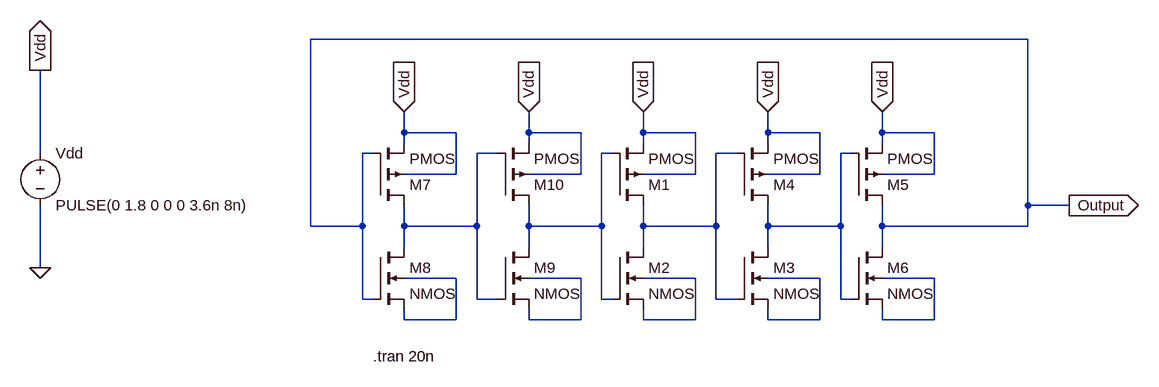
[diagram p0: schematic 5_ring_osc.asc]
5_ring_osc.asc, the LTspice schematic file:
Version 4
SHEET 1 1800 900
WIRE 1104 -96 0 -96
WIRE 144 48 144 16
WIRE 224 48 144 48
WIRE 336 48 336 16
WIRE 416 48 336 48
WIRE 512 48 512 16
WIRE 592 48 512 48
WIRE 704 48 704 16
WIRE 784 48 704 48
WIRE 880 48 880 16
WIRE 960 48 880 48
WIRE 144 64 144 48
WIRE 336 64 336 48
WIRE 512 64 512 48
WIRE 704 64 704 48
WIRE 880 64 880 48
WIRE -416 80 -416 -48
WIRE 96 80 80 80
WIRE 288 80 256 80
WIRE 464 80 448 80
WIRE 656 80 624 80
WIRE 832 80 816 80
WIRE 224 112 224 48
WIRE 224 112 144 112
WIRE 416 112 416 48
WIRE 416 112 336 112
WIRE 592 112 592 48
WIRE 592 112 512 112
WIRE 784 112 784 48
WIRE 784 112 704 112
WIRE 960 112 960 48
WIRE 960 112 880 112
WIRE 1104 160 1104 -96
WIRE 1168 160 1104 160
WIRE 0 192 0 -96
WIRE 80 192 80 80
WIRE 80 192 0 192
WIRE 144 192 144 160
WIRE 256 192 256 80
WIRE 256 192 144 192
WIRE 336 192 336 160
WIRE 448 192 448 80
WIRE 448 192 336 192
WIRE 512 192 512 160
WIRE 624 192 624 80
WIRE 624 192 512 192
WIRE 704 192 704 160
WIRE 816 192 816 80
WIRE 816 192 704 192
WIRE 880 192 880 160
WIRE 1104 192 1104 160
WIRE 1104 192 880 192
WIRE 144 224 144 192
WIRE 336 224 336 192
WIRE 512 224 512 192
WIRE 704 224 704 192
WIRE 880 224 880 192
WIRE -416 256 -416 160
WIRE 224 272 144 272
WIRE 416 272 336 272
WIRE 592 272 512 272
WIRE 784 272 704 272
WIRE 960 272 880 272
WIRE 80 304 80 192
WIRE 96 304 80 304
WIRE 256 304 256 192
WIRE 288 304 256 304
WIRE 448 304 448 192
WIRE 464 304 448 304
WIRE 624 304 624 192
WIRE 656 304 624 304
WIRE 816 304 816 192
WIRE 832 304 816 304
WIRE 144 336 144 320
WIRE 224 336 224 272
WIRE 224 336 144 336
WIRE 336 336 336 320
WIRE 416 336 416 272
WIRE 416 336 336 336
WIRE 512 336 512 320
WIRE 592 336 592 272
WIRE 592 336 512 336
WIRE 704 336 704 320
WIRE 784 336 784 272
WIRE 784 336 704 336
WIRE 880 336 880 320
WIRE 960 336 960 272
WIRE 960 336 880 336
FLAG 512 16 Vdd
IOPIN 512 16 In
FLAG 704 16 Vdd
IOPIN 704 16 In
FLAG 880 16 Vdd
IOPIN 880 16 In
FLAG 1168 160 Output
IOPIN 1168 160 Out
FLAG -416 256 0
FLAG -416 -48 Vdd
IOPIN -416 -48 Out
FLAG 144 16 Vdd
IOPIN 144 16 In
FLAG 336 16 Vdd
IOPIN 336 16 In
SYMBOL pmos4 464 160 M180
SYMATTR InstName M1
SYMATTR Value2 l=180n w=720n
SYMBOL nmos4 464 224 R0
SYMATTR InstName M2
SYMATTR Value2 l=180n w=360n
SYMBOL nmos4 656 224 R0
SYMATTR InstName M3
SYMATTR Value2 l=180n w=360n
SYMBOL pmos4 656 160 M180
SYMATTR InstName M4
SYMATTR Value2 l=180n w=720n
SYMBOL pmos4 832 160 M180
SYMATTR InstName M5
SYMATTR Value2 l=180n w=720n
SYMBOL nmos4 832 224 R0
SYMATTR InstName M6
SYMATTR Value2 l=180n w=360n
SYMBOL voltage -416 64 R0
WINDOW 123 0 0 Left 0
WINDOW 39 0 0 Left 0
SYMATTR InstName Vdd
SYMATTR Value PULSE(0 1.8 0 0 0 3.6n 8n)
SYMBOL pmos4 96 160 M180
SYMATTR InstName M7
SYMATTR Value2 l=180n w=720n
SYMBOL nmos4 96 224 R0
SYMATTR InstName M8
SYMATTR Value2 l=180n w=360n
SYMBOL nmos4 288 224 R0
SYMATTR InstName M9
SYMATTR Value2 l=180n w=360n
SYMBOL pmos4 288 160 M180
SYMATTR InstName M10
SYMATTR Value2 l=180n w=720n
TEXT 96 392 Left 2 !.tran 20n

The netlist it stands for:
* 5_ring_osc.asc
M1 N003 N002 Vdd Vdd PMOS l=180n w=720n
M2 N003 N002 N007 N007 NMOS l=180n w=360n
M3 N004 N003 N008 N008 NMOS l=180n w=360n
M4 N004 N003 Vdd Vdd PMOS l=180n w=720n
M5 Output N004 Vdd Vdd PMOS l=180n w=720n
M6 Output N004 N009 N009 NMOS l=180n w=360n
Vdd Vdd 0 PULSE(0 1.8 0 0 0 3.6n 8n)
M7 N001 Output Vdd Vdd PMOS l=180n w=720n
M8 N001 Output N005 N005 NMOS l=180n w=360n
M9 N002 N001 N006 N006 NMOS l=180n w=360n
M10 N002 N001 Vdd Vdd PMOS l=180n w=720n
.model NMOS NMOS
.model PMOS PMOS
.lib standard.mos
.tran 20n
.backanno
.end